# Altium schematic sheet DB10012_ControlTopLevel.SchDoc: Toplevel schematic
size A4; SheetNumber: 1; SheetTotal: 6
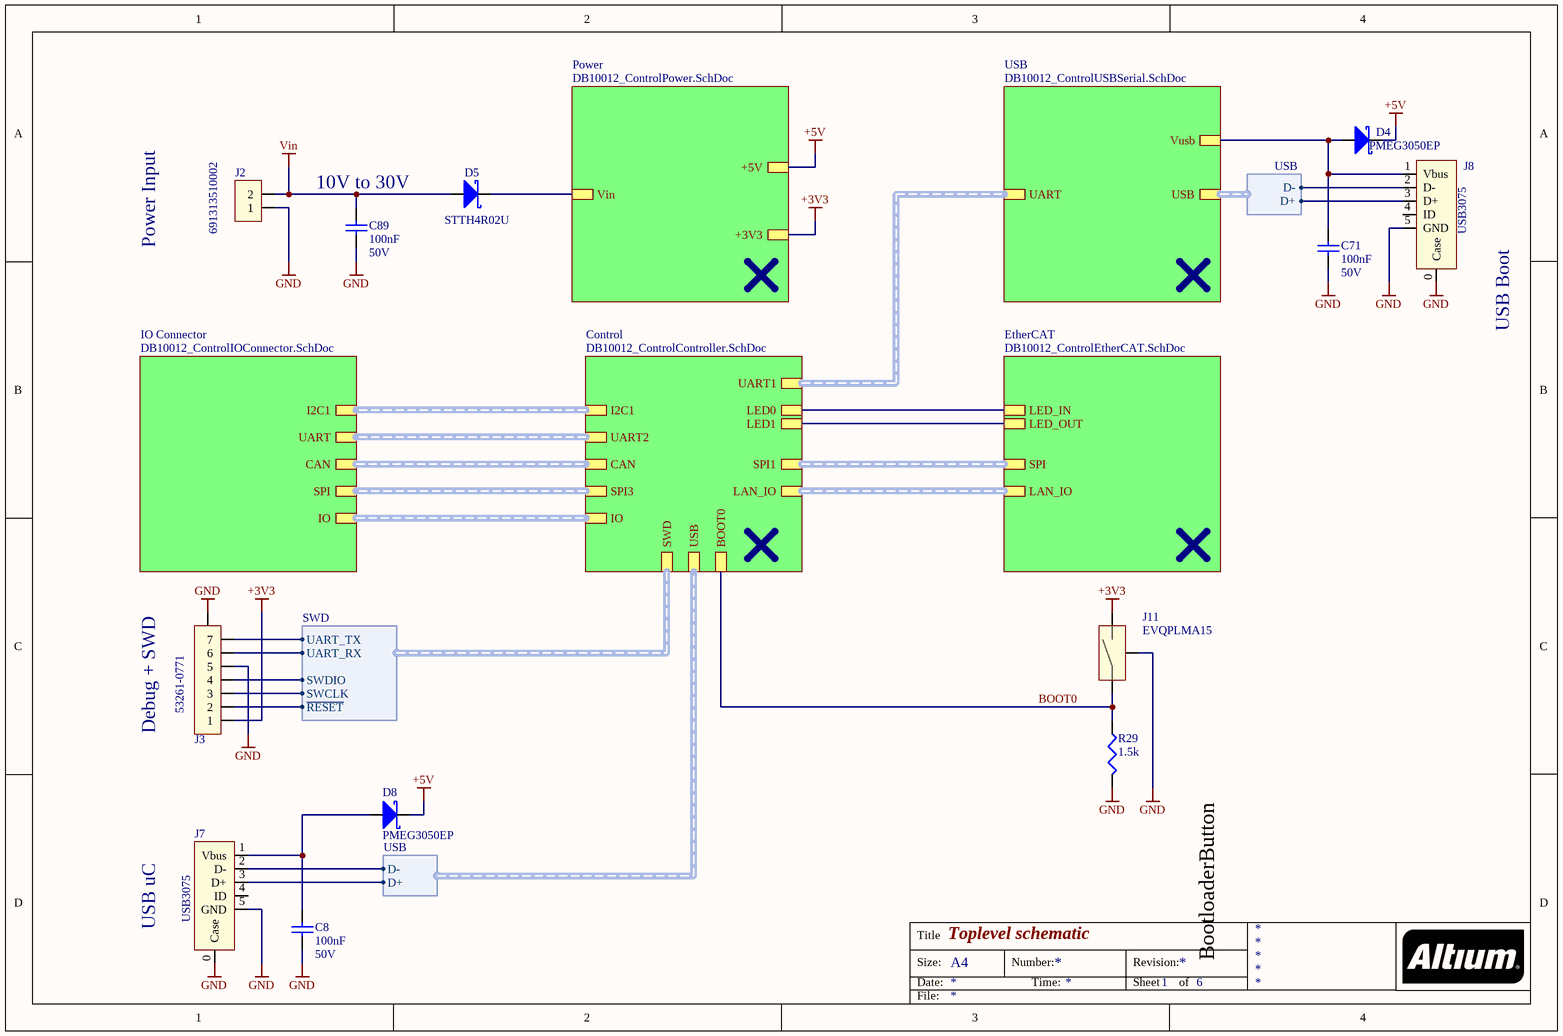
[diagram p0: DB10012_ControlTopLevel.SchDoc]

## Parts
C8  100nF  Voltage Rating: 50V  [C-0805]
C71  100nF  Voltage Rating: 50V  [C-0805]
C89  100nF  Voltage Rating: 50V  [C-0805]
D4  PMEG3050EP  [SOD128]
D5  STTH4R02U  [CASE 403A-03]
D8  PMEG3050EP  [SOD128]
J2  691313510002  [691313510002]
J3  53261-0771  [53261-0771]
J7  USB3075  [USB3075 - NOSLOT]
J8  USB3075  [USB3075 - NOSLOT]
J11  EVQPLMA15  [EVQPLM]
R29  1.5k  [0402]

## Sub-sheets
Control = DB10012_ControlController.SchDoc: SPI1 (harness SPI), LAN_IO (harness LAN_IO), UART1 (harness UART), SPI3 (harness SPI), I2C1 (harness I2C1), CAN (harness CAN), UART2 (harness UART), IO (harness IO), USB (harness USB), SWD (harness SWD), BOOT0, LED0, LED1
EtherCAT = DB10012_ControlEtherCAT.SchDoc: SPI (harness SPI), LAN_IO (harness LAN_IO), LED_IN, LED_OUT
IO Connector = DB10012_ControlIOConnector.SchDoc: SPI (harness SPI), I2C1 (harness I2C1), CAN (harness CAN), IO (harness IO), UART (harness UART)
Power = DB10012_ControlPower.SchDoc: +5V, +3V3, Vin
USB = DB10012_ControlUSBSerial.SchDoc: UART (harness UART), USB (harness USB), Vusb

## Harnesses
SWD: UART_TX, UART_RX, SWDIO, SWCLK, ~{RESET}
USB: D-, D+

## Nets
+3V3: J3.1 J11.2 ; sheet Power/+3V3
+5V: D4.2(K) D8.2(K) ; sheet Power/+5V
GND: C8.1 C71.1 C89.1 J2.1 J3.0(SHLD) J3.5 J7.0(Case) J7.5(GND) J8.0(Case) J8.5(GND) J11.0(GND) R29.1
Vin: C89.2 D5.1(A) J2.2
BOOT0: J11.1 R29.2 ; sheet Control/BOOT0
NetC8_2: C8.2 D8.1(A) J7.1(Vbus)
NetC71_2: C71.2 D4.1(A) J8.1(Vbus) ; sheet USB/Vusb
NetD5_2: D5.2(K) ; sheet Power/Vin
NetJ3_2: J3.2 ; sheet Control/SWD.~{RESET}
NetJ3_3: J3.3 ; sheet Control/SWD.SWCLK
NetJ3_4: J3.4 ; sheet Control/SWD.SWDIO
NetJ3_6: J3.6 ; sheet Control/SWD.UART_RX
NetJ3_7: J3.7 ; sheet Control/SWD.UART_TX
NetJ7_2: J7.2(D-) ; sheet Control/USB.D-
NetJ7_3: J7.3(D+) ; sheet Control/USB.D+
NetJ8_2: J8.2(D-) ; sheet USB/USB.D-
NetJ8_3: J8.3(D+) ; sheet USB/USB.D+
(unnamed): sheet EtherCAT/LED_IN, sheet Control/LED0
(unnamed): sheet EtherCAT/LED_OUT, sheet Control/LED1

Not connected (* = marked no-connect by the designer): J7 4(ID); J8 4(ID)

## Buses and harness runs
harness sheet Control/CAN = sheet IO Connector/CAN
harness sheet Control/I2C1 = sheet IO Connector/I2C1
harness sheet Control/IO = sheet IO Connector/IO
harness sheet Control/LAN_IO = sheet EtherCAT/LAN_IO
harness sheet Control/SPI1 = sheet EtherCAT/SPI
harness sheet Control/SPI3 = sheet IO Connector/SPI
harness sheet Control/UART1 = sheet USB/UART
harness sheet Control/UART2 = sheet IO Connector/UART

## Notes on the sheet
- Power Input
- (near C89) 10V to 30V
- USB Boot
- (near J3) Debug + SWD
- BootloaderButton
- USB uC
- Title
- Size:
- Date:
- A4
- Number:
- Time:
- Revision:
- Sheet
- of
- File:

## Library data of the parts
C8 C71 C89 = 100nF/0805/CER/50V: Capacitor, 100nF, 50V,  X7R; Capacitance Tolerance: ± 10%; Capacitor Case Style: 0805; Brand Number: C0805C104K5RACTU; Brand: KEMET; Dielectric Characteristic: X7R; Capacitance: 100nF; Temperature Range: -55°C to +125°C; Price: 0,022; Order Code Supplier: 1414664; Supplier: Farnell
D4 D8 = PMEG3050EP: Diode Schottky, Vrrm: 30V, If: 3A, Vf: 0.36V; Brand: NXP; Case Style: SOD-128; Forward Current: 5A; Brand Number: PMEG3050EP; Forward Voltage: 0.36V; Order Code Supplier: 1829197; Price: 0,25; Supplier: Farnell; Temperature Range: -55°C to +150°C; Vrrm: 30V
D5 = STTH4R02U: Diode Schottky, Vrrm: 200V, If: 4A, Vf: 1,05V; Brand: STMICROELECTRONICS; Case Style: SMB; Forward Current: 3A; Forward Voltage: 1,05V; Brand Number: STTH4R02U; Order Code Supplier: 1295277; Price: 1,09; Supplier: Farnell; Temperature Range: -65°C to +150°C; Vrrm: 200V
J2 = 691313510002: WR-TBL 313 Series, 2 Contacts, Header, 5.08 mm; Brand: Wurth; Pitch: 5.08mm; Brand Number: 691313510002; Case Style: WR-TBL 313 Series; Order Code Supplier: 1641993; Price: 0,343; Supplier: Farnell
J3 = 53261-0771: PicoBlade 53261 Series, 7Pin, Right Angle; Brand: Molex; Pitch: 1,25mm; Brand Number: 53261-0771; Case Style: 53261-0771; Order Code Supplier: 1125361; Price: 1,80; Supplier: Farnell
J7 J8 = USB3075: USB 2.0 MICRO B, RCPT, 5POS, SMT; Brand: Global Connector Technology; Brand Number: USB3075-30-A; Case Style: Micro B SMT; Pitch: 0.8mm; Order Code Supplier: 2443116; Price: 0,313; Supplier: Farnell
J11 = EVQPLMA15: SWITCH, TACT, 4.9MM, SMD, 2.6N; Brand: PANASONIC ELECTRONIC COMPONENTS; Brand Number: EVQPLMA15; Price: 0,169; Order Code Supplier: 2079484; Supplier: Farnell
R29 = 1.5k/0402/0063W/50V: Resistor, 1.5k, 0.1%, 0.0625W, 50V, 100PPM, 0402; Brand: VISHAY DRALORIC; Brand Number: CRCW04021K50FKED; Power Rating: 0.063W; Case Style: 0402; Order Code Supplier: 2121624; Price: 0,0054; Resistance: 1.5k; Supplier: Farnell; Temperature Coefficient: ± 100PPM; Temperature Range: -55°C to +125°C; Voltage Rating: 50V